# Altium project DUAL_RPS.PrjPcb
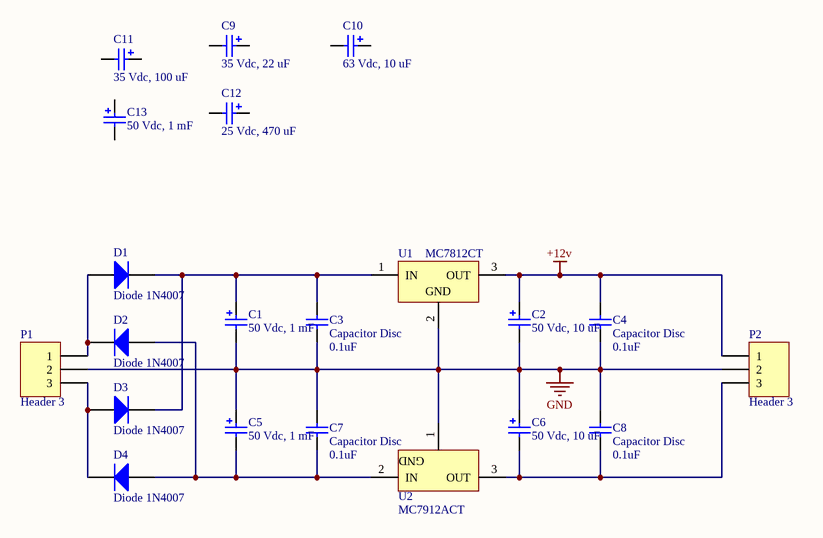
[diagram p0: DUAL_RPS.SchDoc]
1 sheet, 21 parts. Net scope: global (net labels, ports and power ports of the same name join across sheets).
Board file: DUAL_RPS_01.PcbDoc

## Sheet DUAL_RPS.SchDoc
size A4

### Parts
C1  50 Vdc, 1 mF  [WCAP-ATG8_13x25x5]
C2  50 Vdc, 10 uF  [WCAP-ATG8_5x11x2]
C3  Capacitor Disc  value 0.1uF  [RAD-0.3]
C4  Capacitor Disc  value 0.1uF  [RAD-0.3]
C5  50 Vdc, 1 mF  [WCAP-ATG8_13x25x5]
C6  50 Vdc, 10 uF  [WCAP-ATG8_5x11x2]
C7  Capacitor Disc  value 0.1uF  [RAD-0.3]
C8  Capacitor Disc  value 0.1uF  [RAD-0.3]
C9  35 Vdc, 22 uF  [WCAP-ATG8_5x11x2]
C10  63 Vdc, 10 uF  [WCAP-ATG8_5x11x2]
C11  35 Vdc, 100 uF  [WCAP-ATG8_6.3x11x2.5]
C12  25 Vdc, 470 uF  [WCAP-ATG8_8x11.5x3.5]
C13  50 Vdc, 1 mF  [WCAP-ATG8_13x25x5]
D1  Diode 1N4007  [DIO10.46-5.3x2.8]
D2  Diode 1N4007  [DIO10.46-5.3x2.8]
D3  Diode 1N4007  [DIO10.46-5.3x2.8]
D4  Diode 1N4007  [DIO10.46-5.3x2.8]
P1  Header 3  [HDR1X3]
P2  Header 3  [HDR1X3]
U1  MC7812CT  [221A-04]
U2  MC7912ACT  [221A-04]

### Nets
+12v: C2.1(P) C4.2 P2.1 U1.3(OUT)
GND: C1.2(N) C2.2(N) C3.1 C4.1 C5.1(P) C6.1(P) C7.2 C8.2 P1.2 P2.2 U1.2(GND) U2.1(GND)
NetC1_1: C1.1(P) C3.2 D1.2(K) D3.2(K) U1.1(IN)
NetC5_2: C5.2(N) C7.1 D2.1(A) D4.1(A) U2.2(IN)
NetC6_2: C6.2(N) C8.1 P2.3 U2.3(OUT)
NetD1_1: D1.1(A) D2.2(K) P1.1
NetD3_1: D3.1(A) D4.2(K) P1.3

Not connected (* = marked no-connect by the designer): C9 1(P) 2(N); C10 1(P) 2(N); C11 1(P) 2(N); C12 1(P) 2(N); C13 1(P) 2(N)

### Library data of the parts
C1 C5 C13 = 860010678024: WCAP-ATG8 Aluminum Electrolytic Capacitors, 13x25mm, 50 Vdc, 1 mF; Rated Voltage: 50 Vdc; Value: 1 mF; ComponentLink1Description: Manufacturer; ComponentLink1URL: http://www.we-online.de; ComponentLink2Description: Datasheet; ComponentLink2URL: http://katalog.we-online.de/pbs/datasheet/860010678024.pdf; Part Number: 860010678024; Published Date: Sep. 2017; Publisher: Wurth Elektronik; Size: 13x25mm; Life Cycle: 2000h; Operating Temperature: -40 °C up to +85 °C
C2 C6 = 860010672009: WCAP-ATG8 Aluminum Electrolytic Capacitors, 5x11mm, 50 Vdc, 10 uF; Rated Voltage: 50 Vdc; Value: 10 uF; ComponentLink1Description: Manufacturer; ComponentLink1URL: http://www.we-online.de; ComponentLink2Description: Datasheet; ComponentLink2URL: http://katalog.we-online.de/pbs/datasheet/860010672009.pdf; Part Number: 860010672009; Published Date: Sep. 2017; Publisher: Wurth Elektronik; Size: 5x11mm; Life Cycle: 2000h; Operating Temperature: -40 °C up to +85 °C
C3 C4 C7 C8 = Cap: Capacitor; Published: 8-Jun-2000; LatestRevisionDate: 17-Jul-2002; LatestRevisionNote: Re-released for DXP Platform.; PackageReference: RAD-0.3; Publisher: Altium Limited
C9 = 860010572003: WCAP-ATG8 Aluminum Electrolytic Capacitors, 5x11mm, 35 Vdc, 22 uF; Rated Voltage: 35 Vdc; Value: 22 uF; ComponentLink1Description: Manufacturer; ComponentLink1URL: http://www.we-online.de; ComponentLink2Description: Datasheet; ComponentLink2URL: http://katalog.we-online.de/pbs/datasheet/860010572003.pdf; Part Number: 860010572003; Published Date: Sep. 2017; Publisher: Wurth Elektronik; Size: 5x11mm; Life Cycle: 2000h; Operating Temperature: -40 °C up to +85 °C
C10 = 860010772009: WCAP-ATG8 Aluminum Electrolytic Capacitors, 5x11mm, 63 Vdc, 10 uF; Rated Voltage: 63 Vdc; Value: 10 uF; ComponentLink1Description: Manufacturer; ComponentLink1URL: http://www.we-online.de; ComponentLink2Description: Datasheet; ComponentLink2URL: http://katalog.we-online.de/pbs/datasheet/860010772009.pdf; Part Number: 860010772009; Published Date: Sep. 2017; Publisher: Wurth Elektronik; Size: 5x11mm; Life Cycle: 2000h; Operating Temperature: -40 °C up to +85 °C
C11 = 860010573007: WCAP-ATG8 Aluminum Electrolytic Capacitors, 6.3x11mm, 35 Vdc, 100 uF; Rated Voltage: 35 Vdc; Value: 100 uF; ComponentLink1Description: Manufacturer; ComponentLink1URL: http://www.we-online.de; ComponentLink2Description: Datasheet; ComponentLink2URL: http://katalog.we-online.de/pbs/datasheet/860010573007.pdf; Part Number: 860010573007; Published Date: Sep. 2017; Publisher: Wurth Elektronik; Size: 6.3x11mm; Life Cycle: 2000h; Operating Temperature: -40 °C up to +85 °C
C12 = 860010474013: WCAP-ATG8 Aluminum Electrolytic Capacitors, 8x11.5mm, 25 Vdc, 470 uF; Rated Voltage: 25 Vdc; Value: 470 uF; ComponentLink1Description: Manufacturer; ComponentLink1URL: http://www.we-online.de; ComponentLink2Description: Datasheet; ComponentLink2URL: http://katalog.we-online.de/pbs/datasheet/860010474013.pdf; Part Number: 860010474013; Published Date: Sep. 2017; Publisher: Wurth Elektronik; Size: 8x11.5mm; Life Cycle: 2000h; Operating Temperature: -40 °C up to +85 °C
D1-D4 = Diode 1N4007: 1 Amp General Purpose Rectifier; Published: 8-Jun-2000; LatestRevisionDate: 17-Jul-2002; LatestRevisionNote: Re-released for DXP Platform.; DatasheetVersion: 1998; PackageVersion: Aug-1999; PackageReference: DO-41; Publisher: Altium Limited; Code_JEDEC: DO-204-AL; ComponentLink1Description: Manufacturer Link; ComponentLink1URL: http://www.fairchildsemi.com/; ComponentLink2Description: Datasheet; ComponentLink2URL: http://www.fairchildsemi.com/ds/1N%2F1N4001.pdf
P1 P2 = Header 3: Header, 3-Pin; LatestRevisionDate: 17-Jul-2002; LatestRevisionNote: Re-released for DXP Platform.; Publisher: Altium Limited
U1 = MC7812CT: 3-Terminal Positive Fixed Voltage Regulator; Note: Pin 2 is electrically connected to TAB; Published: 17-Jul-2002; DatasheetVersion: 1988; PackageReference: 221A-04; Publisher: Altium Limited; PackageDescription: TO, Thru-Hole, Vertical, Heatsink Mounted; 3 In-Line Leads; Pitch 2.54 mm; Code_JEDEC: TO-262-AA; ComponentLink1Description: Manufacturer Link; ComponentLink1URL: http://www.onsemi.com/site/products/taxonomy/0,4438,503,00.html; ComponentLink2Description: Datasheet; ComponentLink2URL: http://www.onsemi.com/pub/Collateral/MC7800-D.PDF
U2 = MC7912ACT: Three-Terminal Negative Fixed Voltage Regulator; Note: Heatsink suface connected to pin 2.; Published: 17-Jul-2002; DatasheetVersion: 1988; PackageReference: 221A-04; Publisher: Altium Limited; PackageDescription: TO, Thru-Hole, Vertical, Heatsink Mounted; 3 In-Line Leads; Pitch 2.54 mm; Code_JEDEC: TO-262-AA; ComponentLink1Description: Manufacturer Link; ComponentLink1URL: http://www.onsemi.com/site/products/taxonomy/0,4438,503,00.html; ComponentLink2Description: Datasheet; ComponentLink2URL: http://www.onsemi.com/pub/Collateral/MC7900-D.PDF